# EAGLE schematic Lagopus_A (EAGLE 8.0.0)
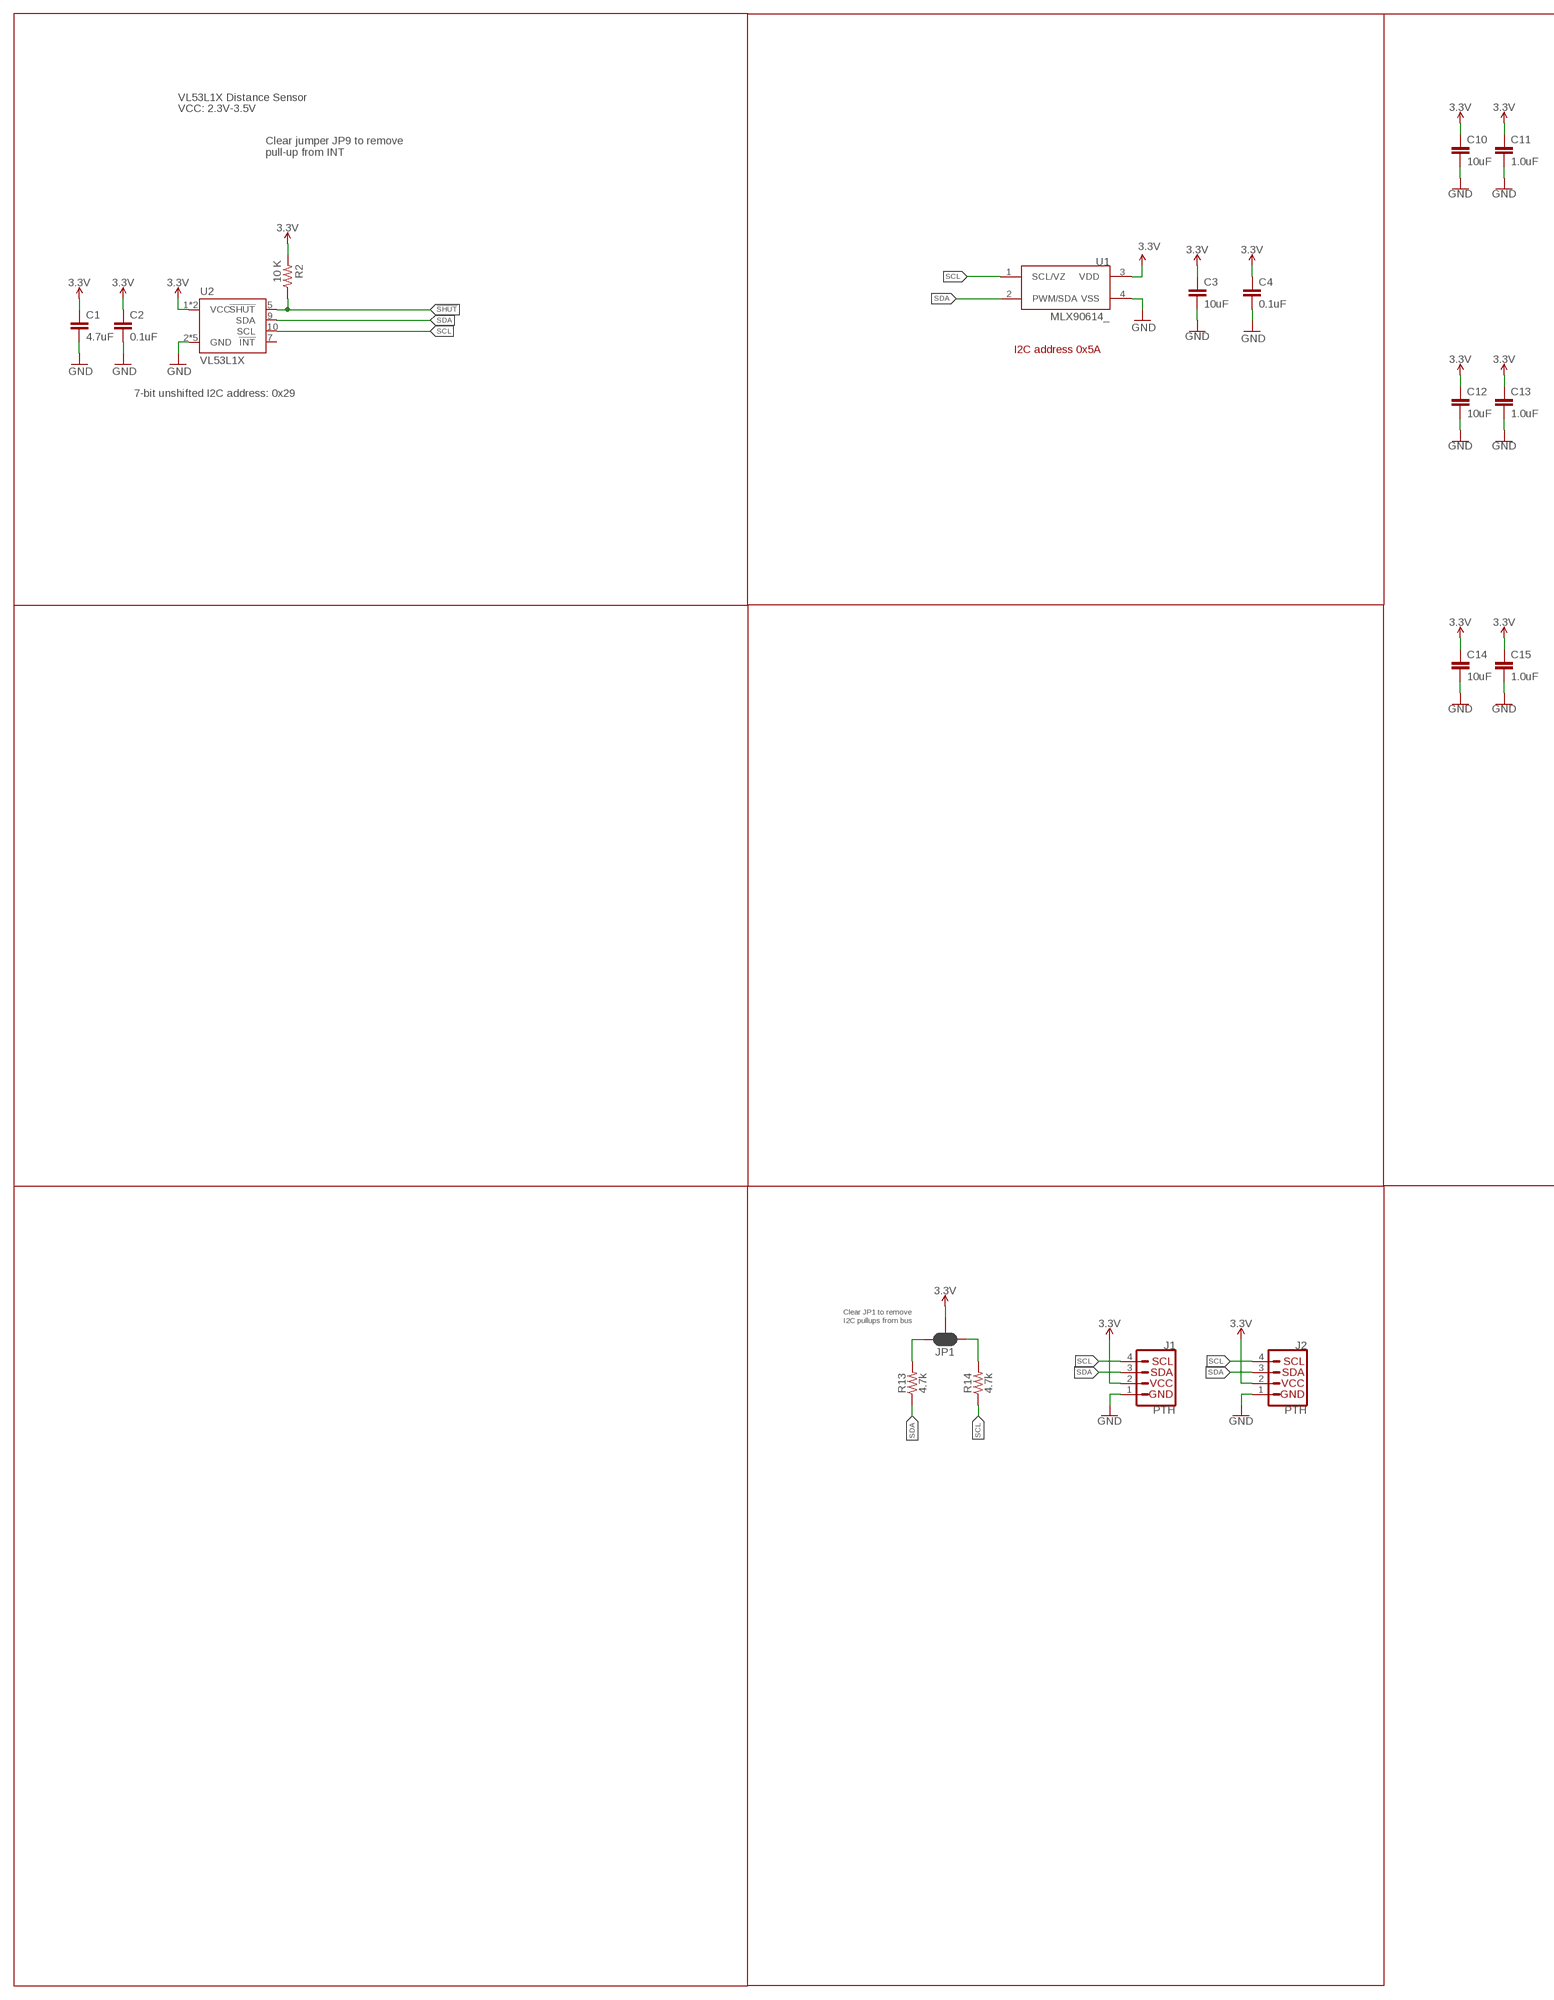
[diagram p0: schematic, sheet 1, part 1 of 2]
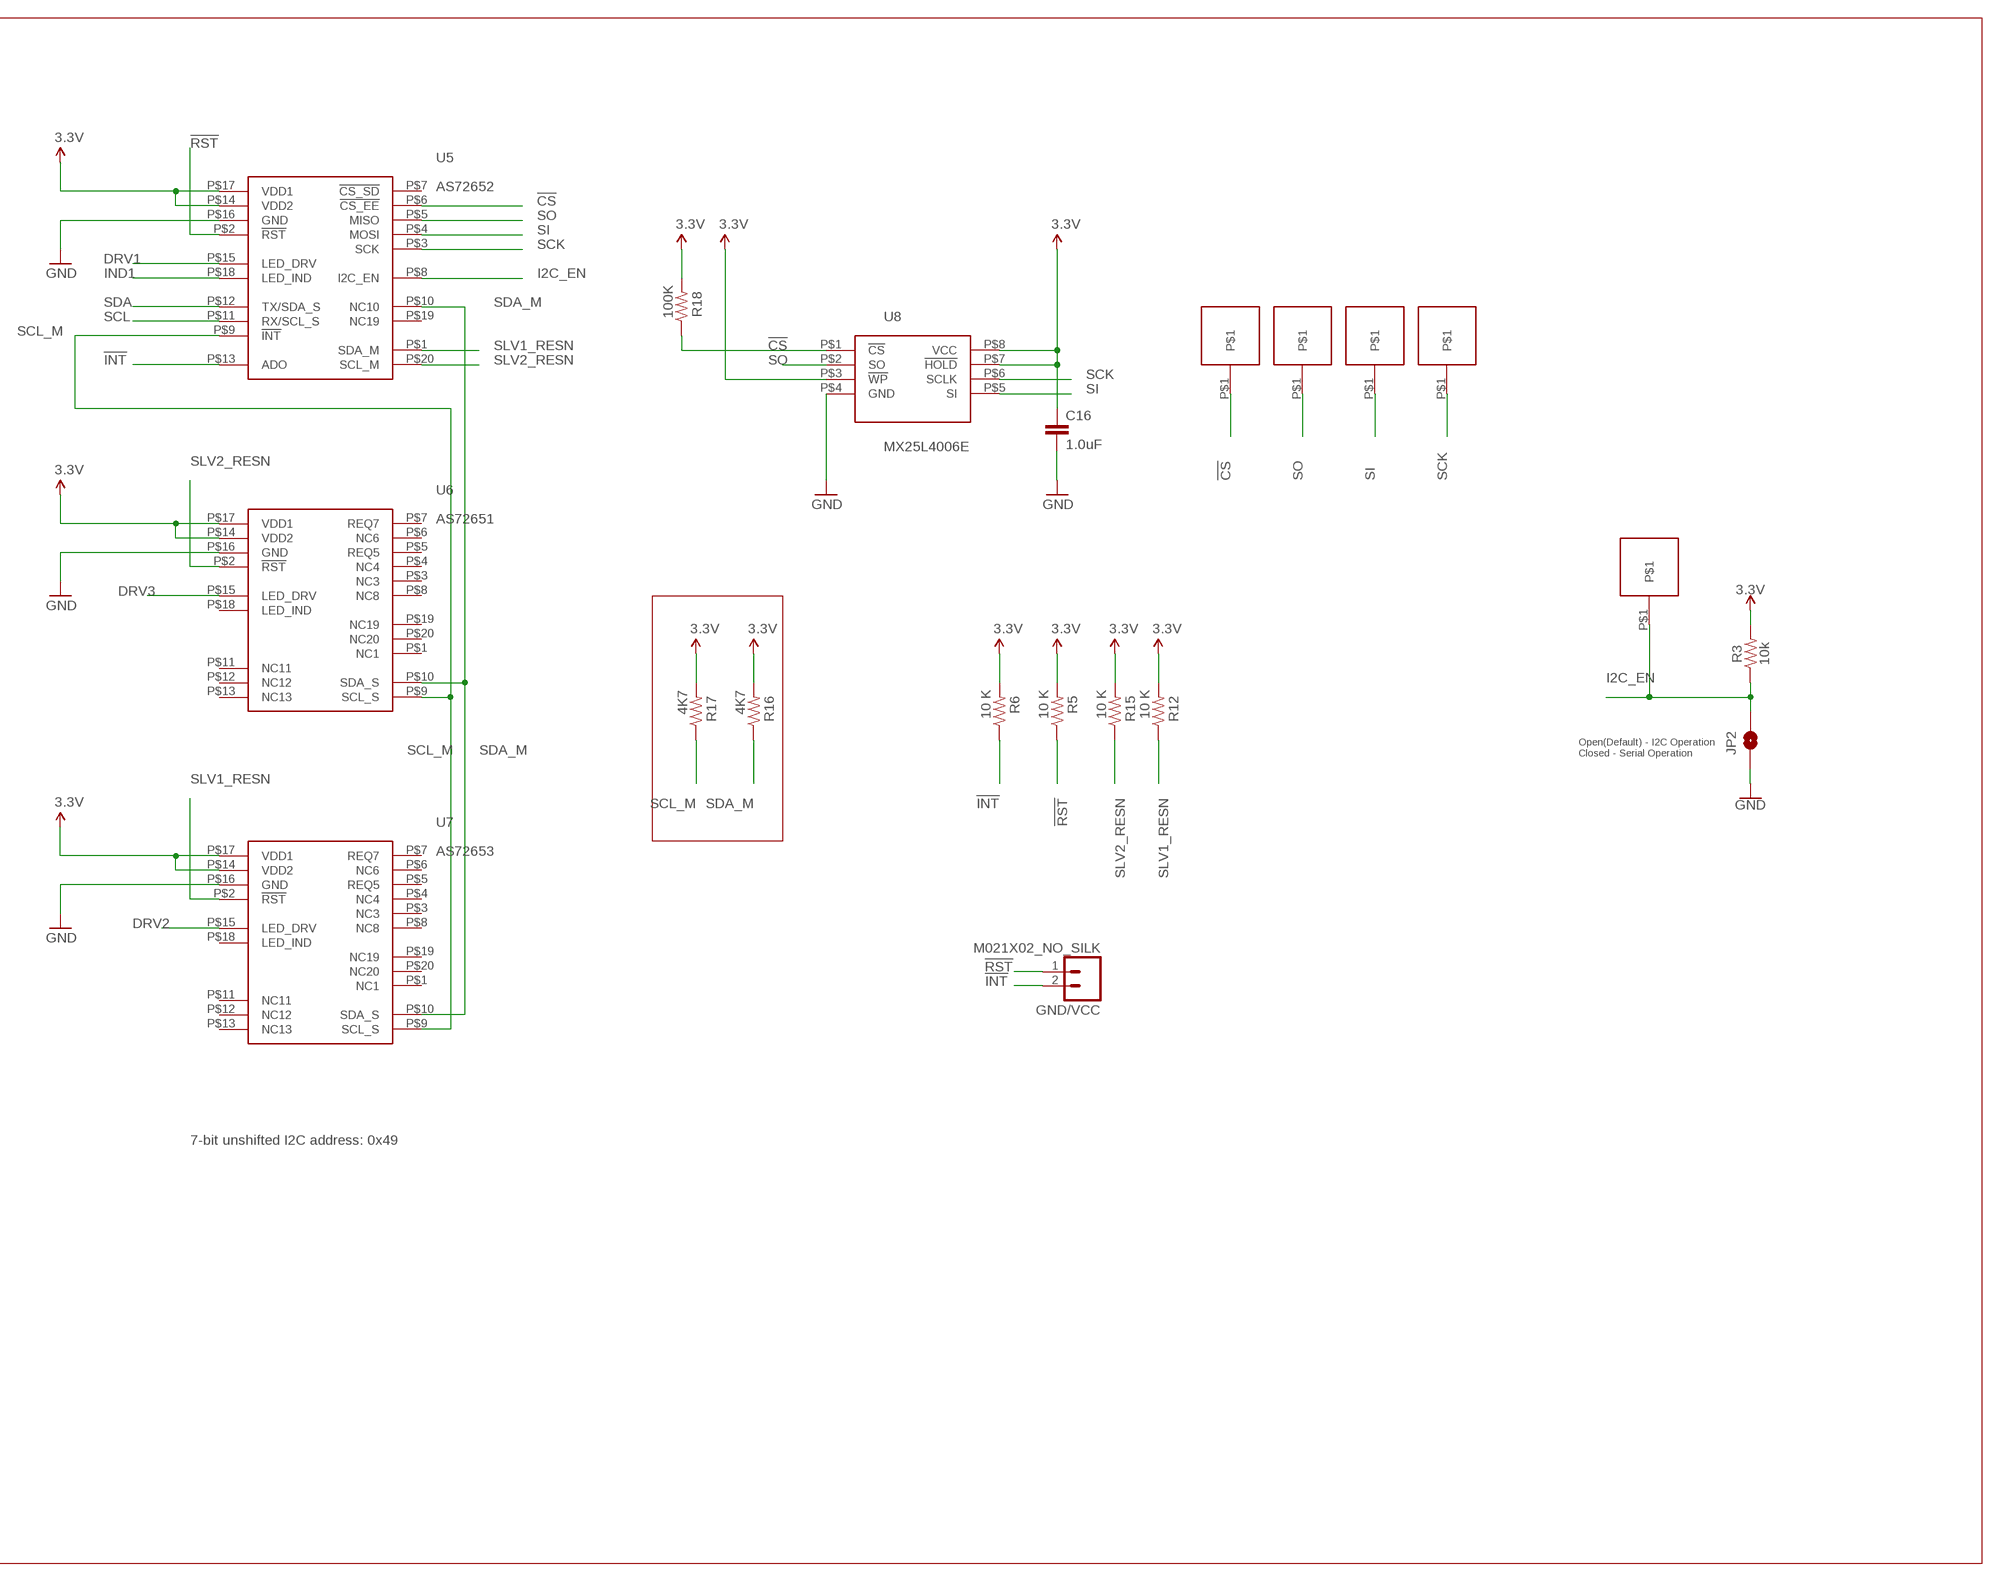
[diagram p1: schematic, sheet 1, part 2 of 2]

## Parts
C1  4.7uF  4.7UF0603  [0603]
C2  0.1uF  0.1UF-0603-25V-(+80/-20%)  [0603]
C3  10uF  10UF-0603-6.3V-20%  [0603]
C4  0.1uF  0.1UF-0603-25V-(+80/-20%)  [0603]
C10  10uF  10UF-0603-6.3V-20%  [0603]
C11  1.0uF  1.0UF-0603-16V-10%  [0603]
C12  10uF  10UF-0603-6.3V-20%  [0603]
C13  1.0uF  1.0UF-0603-16V-10%  [0603]
C14  10uF  10UF-0603-6.3V-20%  [0603]
C15  1.0uF  1.0UF-0603-16V-10%  [0603]
C16  1.0uF  1.0UF-0603-16V-10%  [0603]
GND/VCC  M021X02_NO_SILK  [1X02_NO_SILK]
J1  PTH  I2C_STANDARD_NO_SILK  [1X04_NO_SILK]
J2  PTH  I2C_STANDARD_NO_SILK  [1X04_NO_SILK]
JP1  JUMPER-SMT_3_2-NC_PASTE_SILK  [SMT-JUMPER_3_2-NC_PASTE_SILK]
JP2  JUMPER-SMT_2_NO_SILK  [SMT-JUMPER_2_NO_SILK]
R2  10 K  R-US_  [R0402_B]
R3  10k  10KOHM-0603-1/10W-1%  [0603]
R5  10 K  R-US_  [R0402_B]
R6  10 K  R-US_  [R0402_B]
R12  10 K  R-US_  [R0402_B]
R13  4.7k  4.7KOHM-0603-1/10W-1%  [0603]
R14  4.7k  4.7KOHM-0603-1/10W-1%  [0603]
R15  10 K  R-US_  [R0402_B]
R16  4K7  R-US_  [R0402_B]
R17  4K7  R-US_  [R0402_B]
R18  100K  R-US_  [R0402_B]
U1  MLX90614_  [TO-39]
U2  VL53L1X  VL53L1XSMD  [VL53L1X]
U5  AS72652  AS7265X  [AS7265X]
U6  AS72651  AS72652  [AS7265X]
U7  AS72653  AS72652  [AS7265X]
U8  MX25L4006E  [USON-8]
U$1  HN01  [HN01]
U$2  HN01  [HN01]
U$4  HN01  [HN01]
U$7  HN01  [HN01]
U$8  HN01  [HN01]

## Nets
3.3V: C1.1 C2.1 C3.1 C4.1 C10.1 C11.1 C12.1 C13.1 C14.1 C15.1 C16.1 J1.2(VCC) J2.2(VCC) JP1.2 R2.2 R3.2 R5.2 R6.2 R12.2 R15.2 R16.2 R17.2 R18.2 U1.3(VDD) U2.1(VCC) U2.11(VCC) U5.P$14(VDD2) U5.P$17(VDD1) U6.P$14(VDD2) U6.P$17(VDD1) U7.P$14(VDD2) U7.P$17(VDD1) U8.P$3(!WP) U8.P$7(!HOLD) U8.P$8(VCC)
!CS: R18.1 U5.P$6(!CS_EE) U8.P$1(!CS) U$7.P$1
!INT: GND/VCC.2 R6.1 U5.P$13(ADO)
!RST: GND/VCC.1 R5.1 U5.P$2(!RST)
!SHUT: R2.1 U2.5(!SHUT)
DRV1: U5.P$15(LED_DRV)
DRV2: U7.P$15(LED_DRV)
DRV3: U6.P$15(LED_DRV)
GND: C1.2 C2.2 C3.2 C4.2 C10.2 C11.2 C12.2 C13.2 C14.2 C15.2 C16.2 J1.1(GND) J2.1(GND) JP2.1 U1.4(VSS) U2.2(GND) U2.3(GND) U2.4(GND) U2.6(GND) U2.12(GND) U5.P$16(GND) U6.P$16(GND) U7.P$16(GND) U8.P$4(GND)
I2C_EN: JP2.2 R3.1 U5.P$8(I2C_EN) U$4.P$1
IND1: U5.P$18(LED_IND)
N$7: JP1.3 R13.2
N$8: JP1.1 R14.2
SCK: U5.P$3(SCK) U8.P$6(SCLK) U$2.P$1
SCL: J1.4(SCL) J2.4(SCL) R14.1 U1.1(SCL/VZ) U2.10(SCL) U5.P$11(RX/SCL_S)
SCL_M: R17.1 U5.P$9(!INT) U6.P$9(SCL_S) U7.P$9(SCL_S)
SDA: J1.3(SDA) J2.3(SDA) R13.1 U1.2(PWM/SDA) U2.9(SDA) U5.P$12(TX/SDA_S)
SDA_M: R16.1 U5.P$10(NC10) U6.P$10(SDA_S) U7.P$10(SDA_S)
SI: U5.P$4(MOSI) U8.P$5(SI) U$1.P$1
SLV1_RESN: R12.1 U5.P$1(SDA_M) U7.P$2(!RST)
SLV2_RESN: R15.1 U5.P$20(SCL_M) U6.P$2(!RST)
SO: U5.P$5(MISO) U8.P$2(SO) U$8.P$1
Unconnected: U2.7(!INT) U5.P$7(!CS_SD) U5.P$19(NC19) U6.P$1(NC1) U6.P$3(NC3) U6.P$4(NC4) U6.P$5(REQ5) U6.P$6(NC6) U6.P$7(REQ7) U6.P$8(NC8) U6.P$11(NC11) U6.P$12(NC12) U6.P$13(NC13) U6.P$18(LED_IND) U6.P$19(NC19) U6.P$20(NC20) U7.P$1(NC1) U7.P$3(NC3) U7.P$4(NC4) U7.P$5(REQ5) U7.P$6(NC6) U7.P$7(REQ7) U7.P$8(NC8) U7.P$11(NC11) U7.P$12(NC12) U7.P$13(NC13) U7.P$18(LED_IND) U7.P$19(NC19) U7.P$20(NC20)

## Notes on the sheet
- VL53L1X Distance Sensor
- VCC: 2.3V-3.5V
- Clear jumper JP9 to remove 
  pull-up from INT
- I2C address 0x5A
- 7-bit unshifted I2C address: 0x29
- Open(Default) - I2C Operation
  Closed - Serial Operation
- 7-bit unshifted I2C address: 0x49
- Clear JP1 to remove
  I2C pullups from bus

## Library data of the parts
C1 = SparkFun-Capacitors:4.7UF: 4.7µF ceramic capacitors A capacitor is a passive two-terminal electrical component used to store electrical energy temporarily in an electric field.; PROD_ID: CAP-08280
C2 C4 = SparkFun-Capacitors:0.1UF: 0.1µF ceramic capacitors A capacitor is a passive two-terminal electrical component used to store electrical energy temporarily in an electric field.; PROD_ID: CAP-00810
C3 C10 C12 C14 = SparkFun-Capacitors:10UF: 10.0µF ceramic capacitors A capacitor is a passive two-terminal electrical component used to store electrical energy temporarily in an electric field.; PROD_ID: CAP-11015
C11 C13 C15 C16 = SparkFun-Capacitors:1.0UF: 1µF ceramic capacitors A capacitor is a passive two-terminal electrical component used to store electrical energy temporarily in an electric field.; PROD_ID: CAP-00868
GND/VCC = SparkFun-Connectors:M02: Standard 2-pin 0.1" header. Use with - straight break away headers ( PRT-00116) - right angle break away headers (PRT-00553) - swiss pins (PRT-00743) - machine pins (PRT-00117) - female headers (PRT-00115) Molex polarized connector foot print use with: PRT-08233 with associated crimp pins and housings. 2.54_SCREWTERM for use with PRT-10571. 3.5mm Screw Terminal footprints for PRT-08084 5mm Screw Terminal footprints for use with PRT-08433
J1 J2 = SparkX:I2C_STANDARD: SparkFun I2C Standard Pinout Header SparkFun has standardized on a pinout for all I2C based sensor breakouts. This pinout allows I2C boards to be plugged directly into the headers on Arduino Uno compatible boards, and to be daisy chained easily. Example SparkFun Products: SparkFun Atmospheric Sensor Breakout - BME280 <https://www.sparkfun.com/products/13676> SparkFun Altitude/Pressure Sensor Breakout - MPL3115A2 <https://www.sparkfun.com/products/11084> SparkFun TOF Range Finder Sensor - VL6180 <https://www.sparkfun.com/products/12785>
JP1 = SparkFun-Jumpers:JUMPER-SMT_3_2-NC_PASTE: Normally closed solder jumper (2 of 2 connections) This jumper has an aperture in the stencil to allow solder paste to bridge both connections. Both connections are normally closed (NC). Wick off the solder to open the connection(s). Reapply solder to reclose the connection(s).
JP2 = SparkFun-Jumpers:JUMPER-SMT_2_NO: Normally open jumper This jumper has two pads in close proximity to each other. Apply solder to close the connection. Round pads are easier to solder for beginners, but are a lot larger. SparkFun Product that uses the round pads: SparkFun EL Sequencer <https://www.sparkfun.com/products/12781>
R2 R5 R6 R12 R15-R18 = Spark:R-US_: 0402 Resistor
R3 = SparkFun-Resistors:10KOHM: 10kΩ resistor A resistor is a passive two-terminal electrical component that implements electrical resistance as a circuit element. Resistors act to reduce current flow, and, at the same time, act to lower voltage levels within circuits. - Wikipedia; PROD_ID: RES-00824
R13 R14 = SparkFun-Resistors:4.7KOHM: 4.7kΩ resistor A resistor is a passive two-terminal electrical component that implements electrical resistance as a circuit element. Resistors act to reduce current flow, and, at the same time, act to lower voltage levels within circuits. - Wikipedia; PROD_ID: RES-07857
U1 = SparkFun:MLX90614: Melexis IR Thermometer
U2 = SparkFun-Sensors:VL53L1X: STMicroelectronics VL53L1X - 400 cm IR Laser ToF Sensor VL53L1X is a state-of-the-art ToF laser-ranging sensor, enhancing the ST FlightSense product family. It is the fastest miniature ToF sensor currently on the market with accurate ranging up to 4 m and fast ranging frequency (up to 50 Hz). Housed in a miniature and reflowable package, it integrates a single photon avalanche diode (SPAD) receiving array, a 940 nm invisible laser Class 1 emitter, physical infrared filters, and optics to achieve the best ranging performance in various ambient lighting conditions with a range of cover window options.; PROD_ID: IC-13960
U5 = kris:AS7265X: AS7265X AMG Smart Spectral Sensor http://ams.com/eng/Products/Spectral-Sensing/Multi-spectral-Sensing/AS7265x
U6 U7 = kris:AS72652: AS72652/3
U8 = kris:MX25L4006E: uson-8 package for Macronix MX25L4006E 4 Mbit SPI Fash
U$1 U$2 U$4 U$7 U$8 = PWSONN6:HN01